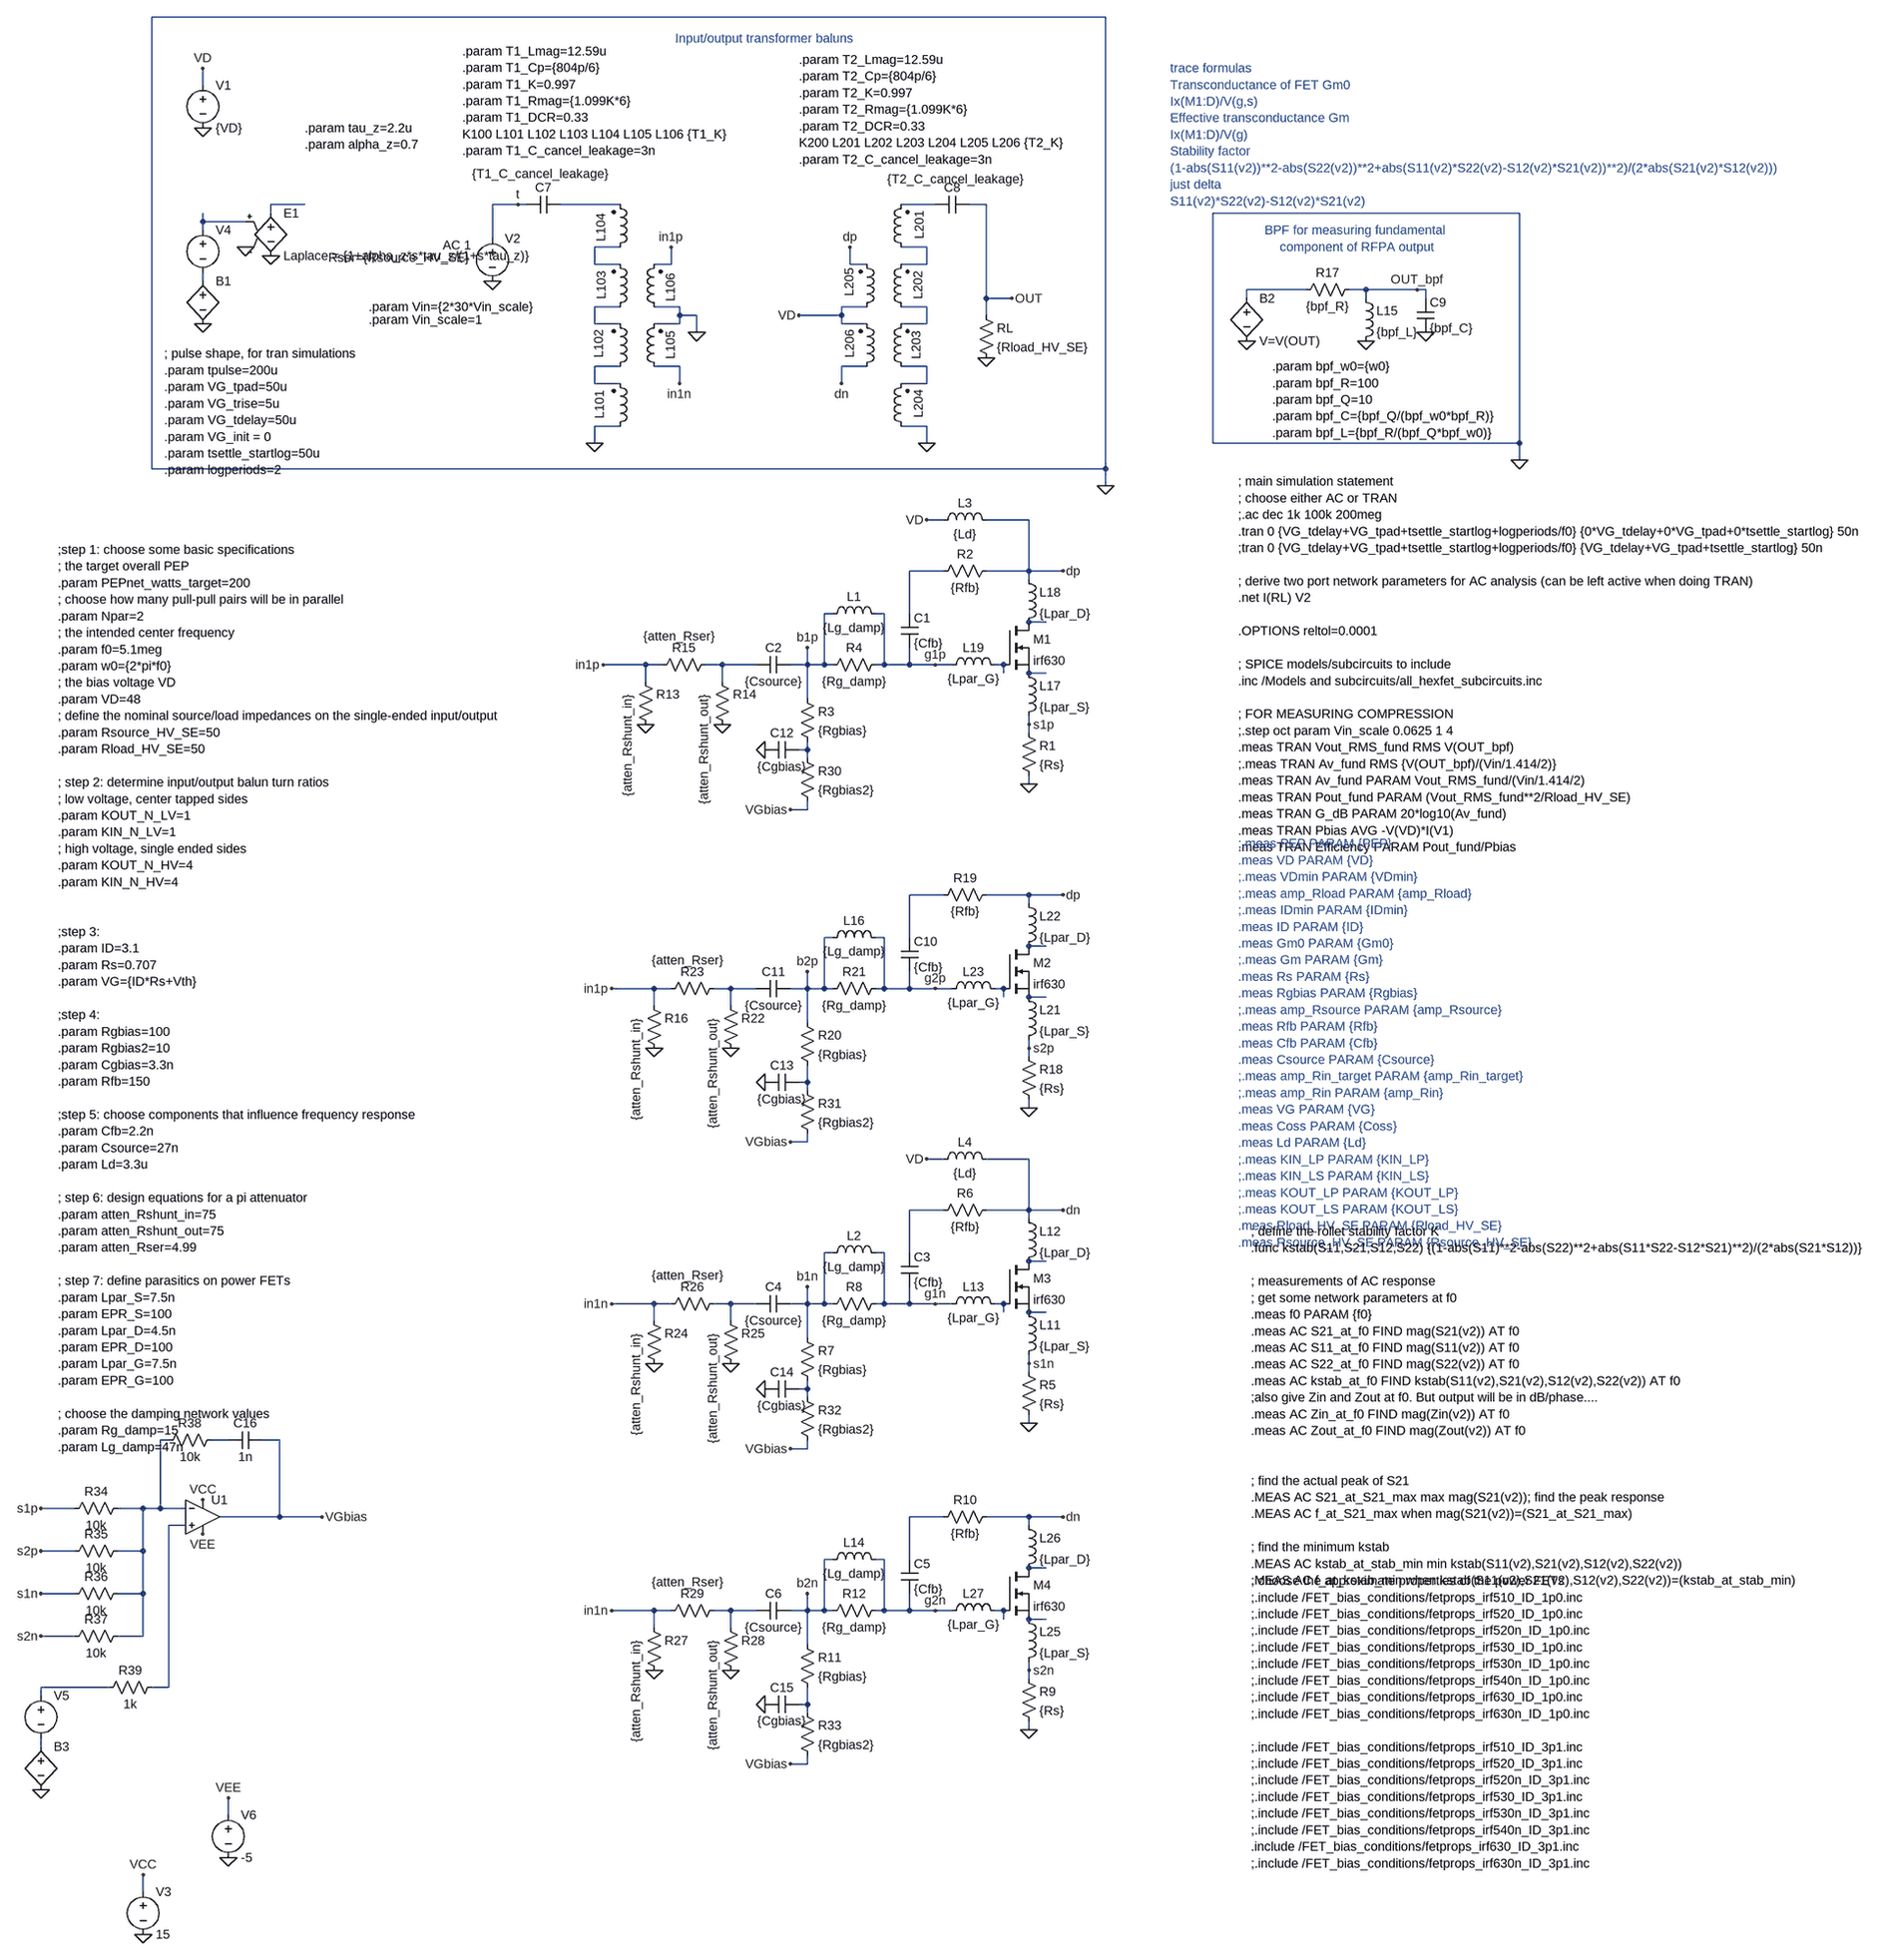
[diagram p0: schematic Easy_RFPA_S2_fixedvalues_DEMO_fasterblanking.asc]
Easy_RFPA_S2_fixedvalues_DEMO_fasterblanking.asc, the LTspice schematic file:
Version 4
SHEET 1 5344 3112
WIRE 160 -1280 -1632 -1280
WIRE -1536 -1152 -1536 -1184
WIRE -1344 -928 -1408 -928
WIRE -944 -928 -992 -928
WIRE -928 -928 -944 -928
WIRE -752 -928 -864 -928
WIRE -160 -928 -224 -928
WIRE -64 -928 -96 -928
WIRE -1408 -912 -1408 -928
WIRE 944 -912 368 -912
WIRE -1536 -896 -1536 -912
WIRE -1456 -896 -1536 -896
WIRE -1536 -880 -1536 -896
WIRE -992 -864 -992 -928
WIRE -752 -848 -800 -848
WIRE -176 -848 -224 -848
WIRE -800 -816 -800 -848
WIRE -752 -816 -800 -816
WIRE -656 -816 -656 -848
WIRE -656 -816 -688 -816
WIRE -320 -816 -320 -848
WIRE -288 -816 -320 -816
WIRE -176 -816 -176 -848
WIRE -176 -816 -224 -816
WIRE -1536 -784 -1536 -800
WIRE 544 -768 432 -768
WIRE 656 -768 624 -768
WIRE 752 -768 656 -768
WIRE 768 -768 752 -768
WIRE -64 -752 -64 -928
WIRE -16 -752 -64 -752
WIRE 432 -752 432 -768
WIRE 656 -752 656 -768
WIRE 768 -752 768 -768
WIRE -752 -736 -800 -736
WIRE -640 -736 -688 -736
WIRE -288 -736 -336 -736
WIRE -176 -736 -224 -736
WIRE -640 -720 -640 -736
WIRE -608 -720 -640 -720
WIRE -336 -720 -336 -736
WIRE -336 -720 -416 -720
WIRE -64 -720 -64 -752
WIRE -800 -704 -800 -736
WIRE -752 -704 -800 -704
WIRE -640 -704 -640 -720
WIRE -640 -704 -688 -704
WIRE -336 -704 -336 -720
WIRE -288 -704 -336 -704
WIRE -176 -704 -176 -736
WIRE -176 -704 -224 -704
WIRE -608 -688 -608 -720
WIRE -752 -624 -800 -624
WIRE -640 -624 -688 -624
WIRE -288 -624 -336 -624
WIRE -176 -624 -224 -624
WIRE -800 -592 -800 -624
WIRE -752 -592 -800 -592
WIRE -640 -592 -640 -624
WIRE -336 -592 -336 -624
WIRE -176 -592 -176 -624
WIRE -176 -592 -224 -592
WIRE -752 -512 -800 -512
WIRE -176 -512 -224 -512
WIRE -800 -480 -800 -512
WIRE -176 -480 -176 -512
WIRE 368 -480 368 -912
WIRE 944 -480 944 -912
WIRE 944 -480 368 -480
WIRE 944 -448 944 -480
WIRE -1632 -432 -1632 -1280
WIRE 160 -432 160 -1280
WIRE 160 -432 -1632 -432
WIRE 160 -400 160 -432
WIRE -144 -336 -176 -336
WIRE 16 -336 -64 -336
WIRE -144 -240 -208 -240
WIRE 16 -240 16 -336
WIRE 16 -240 -64 -240
WIRE 80 -240 16 -240
WIRE 16 -224 16 -240
WIRE -352 -160 -368 -160
WIRE -256 -160 -272 -160
WIRE -208 -160 -208 -240
WIRE 48 -144 16 -144
WIRE -704 -64 -784 -64
WIRE -672 -64 -704 -64
WIRE -560 -64 -592 -64
WIRE -496 -64 -560 -64
WIRE -400 -64 -400 -96
WIRE -400 -64 -432 -64
WIRE -368 -64 -368 -160
WIRE -368 -64 -400 -64
WIRE -352 -64 -368 -64
WIRE -256 -64 -256 -160
WIRE -256 -64 -272 -64
WIRE -208 -64 -208 -96
WIRE -208 -64 -256 -64
WIRE -160 -64 -208 -64
WIRE -128 -64 -160 -64
WIRE -32 -64 -48 -64
WIRE -32 -48 -32 -64
WIRE 48 -48 16 -48
WIRE -704 -32 -704 -64
WIRE -560 -32 -560 -64
WIRE -400 0 -400 -64
WIRE 16 48 16 32
WIRE 16 64 16 48
WIRE -400 96 -400 80
WIRE -400 96 -416 96
WIRE -400 112 -400 96
WIRE 16 160 16 144
WIRE -400 208 -400 192
WIRE -400 208 -432 208
WIRE -144 368 -208 368
WIRE 16 368 -64 368
WIRE 80 368 16 368
WIRE 16 384 16 368
WIRE -352 448 -368 448
WIRE -256 448 -272 448
WIRE -208 448 -208 368
WIRE 48 464 16 464
WIRE -688 544 -768 544
WIRE -656 544 -688 544
WIRE -544 544 -576 544
WIRE -496 544 -544 544
WIRE -400 544 -400 512
WIRE -400 544 -432 544
WIRE -368 544 -368 448
WIRE -368 544 -400 544
WIRE -352 544 -368 544
WIRE -256 544 -256 448
WIRE -256 544 -272 544
WIRE -208 544 -208 512
WIRE -208 544 -256 544
WIRE -160 544 -208 544
WIRE -128 544 -160 544
WIRE -32 544 -48 544
WIRE -32 560 -32 544
WIRE 48 560 16 560
WIRE -688 576 -688 544
WIRE -544 576 -544 544
WIRE -400 608 -400 544
WIRE 16 656 16 640
WIRE 16 672 16 656
WIRE -400 720 -400 688
WIRE -400 720 -416 720
WIRE -400 736 -400 720
WIRE 16 768 16 752
WIRE -400 832 -400 816
WIRE -400 832 -432 832
WIRE -144 864 -176 864
WIRE 16 864 -64 864
WIRE -144 960 -208 960
WIRE 16 960 16 864
WIRE 16 960 -64 960
WIRE 80 960 16 960
WIRE 16 976 16 960
WIRE -352 1040 -368 1040
WIRE -256 1040 -272 1040
WIRE -208 1040 -208 960
WIRE 48 1056 16 1056
WIRE -688 1136 -768 1136
WIRE -656 1136 -688 1136
WIRE -544 1136 -576 1136
WIRE -496 1136 -544 1136
WIRE -400 1136 -400 1104
WIRE -400 1136 -432 1136
WIRE -368 1136 -368 1040
WIRE -368 1136 -400 1136
WIRE -352 1136 -368 1136
WIRE -256 1136 -256 1040
WIRE -256 1136 -272 1136
WIRE -208 1136 -208 1104
WIRE -208 1136 -256 1136
WIRE -160 1136 -208 1136
WIRE -128 1136 -160 1136
WIRE -32 1136 -48 1136
WIRE -32 1152 -32 1136
WIRE 48 1152 16 1152
WIRE -688 1168 -688 1136
WIRE -544 1168 -544 1136
WIRE -400 1200 -400 1136
WIRE 16 1248 16 1232
WIRE 16 1264 16 1248
WIRE -400 1296 -400 1280
WIRE -400 1296 -416 1296
WIRE -400 1312 -400 1296
WIRE 16 1360 16 1344
WIRE -1600 1392 -1616 1392
WIRE -1488 1392 -1520 1392
WIRE -1392 1392 -1424 1392
WIRE -400 1408 -400 1392
WIRE -400 1408 -432 1408
WIRE -1776 1520 -1840 1520
WIRE -1648 1520 -1696 1520
WIRE -1616 1520 -1616 1392
WIRE -1616 1520 -1648 1520
WIRE -1568 1520 -1616 1520
WIRE -1392 1536 -1392 1392
WIRE -1392 1536 -1504 1536
WIRE -1312 1536 -1392 1536
WIRE -144 1536 -208 1536
WIRE 16 1536 -64 1536
WIRE 80 1536 16 1536
WIRE -1568 1552 -1600 1552
WIRE 16 1552 16 1536
WIRE -1776 1600 -1840 1600
WIRE -1648 1600 -1648 1520
WIRE -1648 1600 -1696 1600
WIRE -352 1616 -368 1616
WIRE -256 1616 -272 1616
WIRE -208 1616 -208 1536
WIRE 48 1632 16 1632
WIRE -1776 1680 -1840 1680
WIRE -1648 1680 -1648 1600
WIRE -1648 1680 -1696 1680
WIRE -688 1712 -768 1712
WIRE -656 1712 -688 1712
WIRE -544 1712 -576 1712
WIRE -496 1712 -544 1712
WIRE -400 1712 -400 1680
WIRE -400 1712 -432 1712
WIRE -368 1712 -368 1616
WIRE -368 1712 -400 1712
WIRE -352 1712 -368 1712
WIRE -256 1712 -256 1616
WIRE -256 1712 -272 1712
WIRE -208 1712 -208 1680
WIRE -208 1712 -256 1712
WIRE -160 1712 -208 1712
WIRE -128 1712 -160 1712
WIRE -32 1712 -48 1712
WIRE -32 1728 -32 1712
WIRE 48 1728 16 1728
WIRE -688 1744 -688 1712
WIRE -544 1744 -544 1712
WIRE -1776 1760 -1840 1760
WIRE -1648 1760 -1648 1680
WIRE -1648 1760 -1696 1760
WIRE -400 1776 -400 1712
WIRE 16 1824 16 1808
WIRE 16 1840 16 1824
WIRE -1712 1856 -1840 1856
WIRE -1600 1856 -1600 1552
WIRE -1600 1856 -1632 1856
WIRE -1840 1872 -1840 1856
WIRE -400 1888 -400 1856
WIRE -400 1888 -416 1888
WIRE -400 1904 -400 1888
WIRE 16 1936 16 1920
WIRE -1840 1968 -1840 1952
WIRE -400 2000 -400 1984
WIRE -400 2000 -432 2000
WIRE -1488 2096 -1488 2064
WIRE -1648 2240 -1648 2208
FLAG 16 160 0
FLAG -992 -784 0
FLAG -1536 -1072 0
FLAG 80 -240 dp
FLAG -160 -64 g1p
FLAG 16 48 s1p
FLAG -784 -64 in1p
FLAG -400 -96 b1p
FLAG -176 -336 VD
FLAG -432 208 VGbias
FLAG -64 -640 0
FLAG -1536 -1184 VD
FLAG -1312 1536 VGbias
FLAG -16 -752 OUT
FLAG -1536 -704 0
FLAG 432 -672 0
FLAG 656 -672 0
FLAG 768 -688 0
FLAG 752 -768 OUT_bpf
FLAG 16 768 0
FLAG 80 368 dp
FLAG -160 544 g2p
FLAG 16 656 s2p
FLAG -400 512 b2p
FLAG 16 1360 0
FLAG 80 960 dn
FLAG -160 1136 g1n
FLAG 16 1248 s1n
FLAG -400 1104 b1n
FLAG -176 864 VD
FLAG 16 1936 0
FLAG 80 1536 dn
FLAG -160 1712 g2n
FLAG 16 1824 s2n
FLAG -400 1680 b2n
FLAG -560 48 0
FLAG -704 48 0
FLAG -768 544 in1p
FLAG -544 656 0
FLAG -688 656 0
FLAG -768 1136 in1n
FLAG -544 1248 0
FLAG -688 1248 0
FLAG -768 1712 in1n
FLAG -544 1824 0
FLAG -688 1824 0
FLAG 944 -448 0
FLAG 160 -400 0
FLAG -656 -848 in1p
FLAG -640 -592 in1n
FLAG -800 -480 0
FLAG -608 -688 0
FLAG -944 -928 t
FLAG -176 -480 0
FLAG -320 -848 dp
FLAG -336 -592 dn
FLAG -416 -720 VD
FLAG -480 96 0
FLAG -432 832 VGbias
FLAG -480 720 0
FLAG -432 1408 VGbias
FLAG -480 1296 0
FLAG -432 2000 VGbias
FLAG -480 1888 0
FLAG -1456 -848 0
FLAG -1408 -832 0
FLAG -1648 2320 0
FLAG -1648 2208 VCC
FLAG -1840 1760 s2n
FLAG -1840 1680 s1n
FLAG -1840 1600 s2p
FLAG -1840 1520 s1p
FLAG -1840 2048 0
FLAG -1536 1504 VCC
FLAG -1488 2176 0
FLAG -1488 2064 VEE
FLAG -1536 1568 VEE
SYMBOL res 0 48 R0
SYMATTR InstName R1
SYMATTR Value {Rs}
SYMBOL res -48 -256 R90
WINDOW 0 0 56 VBottom 2
WINDOW 3 32 56 VTop 2
SYMATTR InstName R2
SYMATTR Value {Rfb}
SYMBOL cap -224 -160 R0
SYMATTR InstName C1
SYMATTR Value {Cfb}
SYMBOL res -416 -16 R0
SYMATTR InstName R3
SYMATTR Value {Rgbias}
SYMBOL res -256 -80 R90
WINDOW 0 0 56 VBottom 2
WINDOW 3 32 56 VTop 2
SYMATTR InstName R4
SYMATTR Value {Rg_damp}
SYMBOL ind -368 -144 R270
WINDOW 0 32 56 VTop 2
WINDOW 3 5 56 VBottom 2
SYMATTR InstName L1
SYMATTR Value {Lg_damp}
SYMBOL cap -432 -80 R90
WINDOW 0 0 32 VBottom 2
WINDOW 3 32 32 VTop 2
SYMATTR InstName C2
SYMATTR Value {Csource}
SYMBOL voltage -1536 -1168 R0
WINDOW 123 0 0 Left 0
WINDOW 39 0 0 Left 0
SYMATTR InstName V1
SYMATTR Value {VD}
SYMBOL ind -160 -320 R270
WINDOW 0 32 56 VTop 2
WINDOW 3 5 56 VBottom 2
SYMATTR InstName L3
SYMATTR Value {Ld}
SYMBOL res -80 -736 R0
SYMATTR InstName RL
SYMATTR Value {Rload_HV_SE}
SYMBOL voltage -1536 -896 R0
WINDOW 3 24 96 Invisible 2
WINDOW 123 0 0 Left 0
WINDOW 39 0 0 Left 0
SYMATTR Value PULSE({VG_init} {VG} {VG_tdelay} {VG_trise} {VG_trise} {VG_tpad*2+tpulse-VG_trise} 10m)
SYMATTR InstName V4
SYMBOL voltage -992 -880 R0
WINDOW 3 -46 82 Invisible 2
WINDOW 123 -40 28 Right 2
WINDOW 39 -45 52 Right 2
SYMATTR Value SINE(0 {Vin} {f0} {VG_tdelay+VG_tpad} 0 0 {tpulse*f0})
SYMATTR Value2 AC 1
SYMATTR SpiceLine Rser={Rsource_HV_SE}
SYMATTR InstName V2
SYMBOL bv -1536 -800 R0
WINDOW 3 24 96 Invisible 2
SYMATTR Value V=VG*smallsig()
SYMATTR InstName B1
SYMBOL bv 432 -768 R0
SYMATTR InstName B2
SYMATTR Value V=V(OUT)
SYMBOL res 640 -784 R90
WINDOW 0 0 56 VBottom 2
WINDOW 3 32 56 VTop 2
SYMATTR InstName R17
SYMATTR Value {bpf_R}
SYMBOL ind 640 -768 R0
SYMATTR InstName L15
SYMATTR Value {bpf_L}
SYMBOL cap 752 -752 R0
SYMATTR InstName C9
SYMATTR Value {bpf_C}
SYMBOL nmos -32 -144 R0
SYMATTR InstName M1
SYMATTR Value irf630
SYMATTR Prefix X
SYMBOL ind 0 -64 R0
SYMATTR InstName L17
SYMATTR Value {Lpar_S}
SYMATTR SpiceLine Rpar={EPR_S}
SYMBOL ind 0 -240 R0
SYMATTR InstName L18
SYMATTR Value {Lpar_D}
SYMATTR SpiceLine Rpar={EPR_D}
SYMBOL ind -144 -48 R270
WINDOW 0 32 56 VTop 2
WINDOW 3 5 56 VBottom 2
SYMATTR InstName L19
SYMATTR Value {Lpar_G}
SYMATTR SpiceLine Rpar={EPR_G}
SYMBOL res 0 656 R0
SYMATTR InstName R18
SYMATTR Value {Rs}
SYMBOL res -48 352 R90
WINDOW 0 0 56 VBottom 2
WINDOW 3 32 56 VTop 2
SYMATTR InstName R19
SYMATTR Value {Rfb}
SYMBOL cap -224 448 R0
SYMATTR InstName C10
SYMATTR Value {Cfb}
SYMBOL res -416 592 R0
SYMATTR InstName R20
SYMATTR Value {Rgbias}
SYMBOL res -256 528 R90
WINDOW 0 0 56 VBottom 2
WINDOW 3 32 56 VTop 2
SYMATTR InstName R21
SYMATTR Value {Rg_damp}
SYMBOL ind -368 464 R270
WINDOW 0 32 56 VTop 2
WINDOW 3 5 56 VBottom 2
SYMATTR InstName L16
SYMATTR Value {Lg_damp}
SYMBOL cap -432 528 R90
WINDOW 0 0 32 VBottom 2
WINDOW 3 32 32 VTop 2
SYMATTR InstName C11
SYMATTR Value {Csource}
SYMBOL nmos -32 464 R0
SYMATTR InstName M2
SYMATTR Value irf630
SYMATTR Prefix X
SYMBOL ind 0 544 R0
SYMATTR InstName L21
SYMATTR Value {Lpar_S}
SYMATTR SpiceLine Rpar={EPR_S}
SYMBOL ind 0 368 R0
SYMATTR InstName L22
SYMATTR Value {Lpar_D}
SYMATTR SpiceLine Rpar={EPR_D}
SYMBOL ind -144 560 R270
WINDOW 0 32 56 VTop 2
WINDOW 3 5 56 VBottom 2
SYMATTR InstName L23
SYMATTR Value {Lpar_G}
SYMATTR SpiceLine Rpar={EPR_G}
SYMBOL res 0 1248 R0
SYMATTR InstName R5
SYMATTR Value {Rs}
SYMBOL res -48 944 R90
WINDOW 0 0 56 VBottom 2
WINDOW 3 32 56 VTop 2
SYMATTR InstName R6
SYMATTR Value {Rfb}
SYMBOL cap -224 1040 R0
SYMATTR InstName C3
SYMATTR Value {Cfb}
SYMBOL res -416 1184 R0
SYMATTR InstName R7
SYMATTR Value {Rgbias}
SYMBOL res -256 1120 R90
WINDOW 0 0 56 VBottom 2
WINDOW 3 32 56 VTop 2
SYMATTR InstName R8
SYMATTR Value {Rg_damp}
SYMBOL ind -368 1056 R270
WINDOW 0 32 56 VTop 2
WINDOW 3 5 56 VBottom 2
SYMATTR InstName L2
SYMATTR Value {Lg_damp}
SYMBOL cap -432 1120 R90
WINDOW 0 0 32 VBottom 2
WINDOW 3 32 32 VTop 2
SYMATTR InstName C4
SYMATTR Value {Csource}
SYMBOL ind -160 880 R270
WINDOW 0 32 56 VTop 2
WINDOW 3 5 56 VBottom 2
SYMATTR InstName L4
SYMATTR Value {Ld}
SYMBOL nmos -32 1056 R0
SYMATTR InstName M3
SYMATTR Value irf630
SYMATTR Prefix X
SYMBOL ind 0 1136 R0
SYMATTR InstName L11
SYMATTR Value {Lpar_S}
SYMATTR SpiceLine Rpar={EPR_S}
SYMBOL ind 0 960 R0
SYMATTR InstName L12
SYMATTR Value {Lpar_D}
SYMATTR SpiceLine Rpar={EPR_D}
SYMBOL ind -144 1152 R270
WINDOW 0 32 56 VTop 2
WINDOW 3 5 56 VBottom 2
SYMATTR InstName L13
SYMATTR Value {Lpar_G}
SYMATTR SpiceLine Rpar={EPR_G}
SYMBOL res 0 1824 R0
SYMATTR InstName R9
SYMATTR Value {Rs}
SYMBOL res -48 1520 R90
WINDOW 0 0 56 VBottom 2
WINDOW 3 32 56 VTop 2
SYMATTR InstName R10
SYMATTR Value {Rfb}
SYMBOL cap -224 1616 R0
SYMATTR InstName C5
SYMATTR Value {Cfb}
SYMBOL res -416 1760 R0
SYMATTR InstName R11
SYMATTR Value {Rgbias}
SYMBOL res -256 1696 R90
WINDOW 0 0 56 VBottom 2
WINDOW 3 32 56 VTop 2
SYMATTR InstName R12
SYMATTR Value {Rg_damp}
SYMBOL ind -368 1632 R270
WINDOW 0 32 56 VTop 2
WINDOW 3 5 56 VBottom 2
SYMATTR InstName L14
SYMATTR Value {Lg_damp}
SYMBOL cap -432 1696 R90
WINDOW 0 0 32 VBottom 2
WINDOW 3 32 32 VTop 2
SYMATTR InstName C6
SYMATTR Value {Csource}
SYMBOL nmos -32 1632 R0
SYMATTR InstName M4
SYMATTR Value irf630
SYMATTR Prefix X
SYMBOL ind 0 1712 R0
SYMATTR InstName L25
SYMATTR Value {Lpar_S}
SYMATTR SpiceLine Rpar={EPR_S}
SYMBOL ind 0 1536 R0
SYMATTR InstName L26
SYMATTR Value {Lpar_D}
SYMATTR SpiceLine Rpar={EPR_D}
SYMBOL ind -144 1728 R270
WINDOW 0 32 56 VTop 2
WINDOW 3 5 56 VBottom 2
SYMATTR InstName L27
SYMATTR Value {Lpar_G}
SYMATTR SpiceLine Rpar={EPR_G}
SYMBOL res -720 -48 R0
WINDOW 3 -18 39 VRight 2
SYMATTR Value {atten_Rshunt_in}
SYMATTR InstName R13
SYMBOL res -576 -48 R0
WINDOW 3 -18 39 VRight 2
SYMATTR Value {atten_Rshunt_out}
SYMATTR InstName R14
SYMBOL res -576 -80 R90
WINDOW 0 0 56 VBottom 2
WINDOW 3 -53 65 VTop 2
SYMATTR InstName R15
SYMATTR Value {atten_Rser}
SYMBOL res -704 560 R0
WINDOW 3 -18 39 VRight 2
SYMATTR Value {atten_Rshunt_in}
SYMATTR InstName R16
SYMBOL res -560 560 R0
WINDOW 3 -18 39 VRight 2
SYMATTR Value {atten_Rshunt_out}
SYMATTR InstName R22
SYMBOL res -560 528 R90
WINDOW 0 0 56 VBottom 2
WINDOW 3 -53 65 VTop 2
SYMATTR InstName R23
SYMATTR Value {atten_Rser}
SYMBOL res -704 1152 R0
WINDOW 3 -18 39 VRight 2
SYMATTR Value {atten_Rshunt_in}
SYMATTR InstName R24
SYMBOL res -560 1152 R0
WINDOW 3 -18 39 VRight 2
SYMATTR Value {atten_Rshunt_out}
SYMATTR InstName R25
SYMBOL res -560 1120 R90
WINDOW 0 0 56 VBottom 2
WINDOW 3 -53 65 VTop 2
SYMATTR InstName R26
SYMATTR Value {atten_Rser}
SYMBOL res -704 1728 R0
WINDOW 3 -18 39 VRight 2
SYMATTR Value {atten_Rshunt_in}
SYMATTR InstName R27
SYMBOL res -560 1728 R0
WINDOW 3 -18 39 VRight 2
SYMATTR Value {atten_Rshunt_out}
SYMATTR InstName R28
SYMBOL res -560 1696 R90
WINDOW 0 0 56 VBottom 2
WINDOW 3 -53 65 VTop 2
SYMATTR InstName R29
SYMATTR Value {atten_Rser}
SYMBOL ind2 -768 -496 M180
WINDOW 3 36 40 Invisible 2
WINDOW 0 -22 83 VLeft 2
SYMATTR Value {T1_Lmag}
SYMATTR InstName L101
SYMATTR Type ind
SYMATTR SpiceLine Rser={T1_DCR} Rpar={T1_Rmag} Cpar={T1_Cp}
SYMBOL ind2 -768 -608 M180
WINDOW 3 36 40 Invisible 2
WINDOW 0 -24 85 VLeft 2
SYMATTR Value {T1_Lmag}
SYMATTR InstName L102
SYMATTR Type ind
SYMATTR SpiceLine Rser={T1_DCR} Rpar={T1_Rmag} Cpar={T1_Cp}
SYMBOL ind2 -768 -720 M180
WINDOW 3 36 40 Invisible 2
WINDOW 0 -19 83 VLeft 2
SYMATTR Value {T1_Lmag}
SYMATTR InstName L103
SYMATTR Type ind
SYMATTR SpiceLine Rser={T1_DCR} Rpar={T1_Rmag} Cpar={T1_Cp}
SYMBOL ind2 -768 -832 M180
WINDOW 3 36 40 Invisible 2
WINDOW 0 -20 80 VLeft 2
SYMATTR Value {T1_Lmag}
SYMATTR InstName L104
SYMATTR Type ind
SYMATTR SpiceLine Rser={T1_DCR} Rpar={T1_Rmag} Cpar={T1_Cp}
SYMBOL ind2 -672 -608 R180
WINDOW 3 36 40 Invisible 2
WINDOW 0 -15 29 VRight 2
SYMATTR Value {T1_Lmag}
SYMATTR InstName L105
SYMATTR Type ind
SYMATTR SpiceLine Rser={T1_DCR} Rpar={T1_Rmag} Cpar={T1_Cp}
SYMBOL ind2 -672 -720 R180
WINDOW 3 36 40 Invisible 2
WINDOW 0 -15 25 VRight 2
SYMATTR Value {T1_Lmag}
SYMATTR InstName L106
SYMATTR Type ind
SYMATTR SpiceLine Rser={T1_DCR} Rpar={T1_Rmag} Cpar={T1_Cp}
SYMBOL cap -928 -912 R270
WINDOW 3 89 27 VBottom 2
WINDOW 0 32 32 VTop 2
SYMATTR Value {T1_C_cancel_leakage}
SYMATTR InstName C7
SYMBOL ind2 -208 -496 R180
WINDOW 3 36 40 Invisible 2
WINDOW 0 -17 31 VRight 2
SYMATTR Value {T2_Lmag}
SYMATTR InstName L204
SYMATTR Type ind
SYMATTR SpiceLine Rser={T2_DCR} Rpar={T2_Rmag} Cpar={T2_Cp}
SYMBOL ind2 -208 -608 R180
WINDOW 3 36 40 Invisible 2
WINDOW 0 -13 29 VRight 2
SYMATTR Value {T2_Lmag}
SYMATTR InstName L203
SYMATTR Type ind
SYMATTR SpiceLine Rser={T2_DCR} Rpar={T2_Rmag} Cpar={T2_Cp}
SYMBOL ind2 -208 -720 R180
WINDOW 3 36 40 Invisible 2
WINDOW 0 -16 29 VRight 2
SYMATTR Value {T2_Lmag}
SYMATTR InstName L202
SYMATTR Type ind
SYMATTR SpiceLine Rser={T2_DCR} Rpar={T2_Rmag} Cpar={T2_Cp}
SYMBOL ind2 -208 -832 R180
WINDOW 3 36 40 Invisible 2
WINDOW 0 -19 31 VRight 2
SYMATTR Value {T2_Lmag}
SYMATTR InstName L201
SYMATTR Type ind
SYMATTR SpiceLine Rser={T2_DCR} Rpar={T2_Rmag} Cpar={T2_Cp}
SYMBOL ind2 -304 -608 M180
WINDOW 3 36 40 Invisible 2
WINDOW 0 -16 85 VLeft 2
SYMATTR Value {T2_Lmag}
SYMATTR InstName L206
SYMATTR Type ind
SYMATTR SpiceLine Rser={T2_DCR} Rpar={T2_Rmag} Cpar={T2_Cp}
SYMBOL ind2 -304 -720 M180
WINDOW 3 36 40 Invisible 2
WINDOW 0 -17 89 VLeft 2
SYMATTR Value {T2_Lmag}
SYMATTR InstName L205
SYMATTR Type ind
SYMATTR SpiceLine Rser={T2_DCR} Rpar={T2_Rmag} Cpar={T2_Cp}
SYMBOL cap -96 -944 R90
WINDOW 3 -47 25 VTop 2
WINDOW 0 0 32 VBottom 2
SYMATTR Value {T2_C_cancel_leakage}
SYMATTR InstName C8
SYMBOL res -416 96 R0
SYMATTR InstName R30
SYMATTR Value {Rgbias2}
SYMBOL cap -416 80 R90
WINDOW 0 0 32 VBottom 2
WINDOW 3 32 32 VTop 2
SYMATTR InstName C12
SYMATTR Value {Cgbias}
SYMBOL res -416 720 R0
SYMATTR InstName R31
SYMATTR Value {Rgbias2}
SYMBOL cap -416 704 R90
WINDOW 0 0 32 VBottom 2
WINDOW 3 32 32 VTop 2
SYMATTR InstName C13
SYMATTR Value {Cgbias}
SYMBOL res -416 1296 R0
SYMATTR InstName R32
SYMATTR Value {Rgbias2}
SYMBOL cap -416 1280 R90
WINDOW 0 0 32 VBottom 2
WINDOW 3 32 32 VTop 2
SYMATTR InstName C14
SYMATTR Value {Cgbias}
SYMBOL res -416 1888 R0
SYMATTR InstName R33
SYMATTR Value {Rgbias2}
SYMBOL cap -416 1872 R90
WINDOW 0 0 32 VBottom 2
WINDOW 3 32 32 VTop 2
SYMATTR InstName C15
SYMATTR Value {Cgbias}
SYMBOL e -1408 -928 R0
SYMATTR InstName E1
SYMATTR Value Laplace = {1+alpha_z*s*tau_z/(1+s*tau_z)}
SYMBOL Opamps\\UniversalOpamp2 -1536 1536 R0
SYMATTR InstName U1
SYMATTR Value2 Avol=1Meg GBW=50Meg Slew=10Meg
SYMATTR SpiceLine ilimit=1 rail=0 Vos=0 phimargin=45
SYMBOL voltage -1648 2224 R0
WINDOW 123 0 0 Left 0
WINDOW 39 0 0 Left 0
SYMATTR InstName V3
SYMATTR Value 15
SYMBOL res -1680 1504 R90
WINDOW 0 0 56 VBottom 2
WINDOW 3 32 56 VTop 2
SYMATTR InstName R34
SYMATTR Value 10k
SYMBOL res -1680 1584 R90
WINDOW 0 0 56 VBottom 2
WINDOW 3 32 56 VTop 2
SYMATTR InstName R35
SYMATTR Value 10k
SYMBOL res -1680 1664 R90
WINDOW 0 0 56 VBottom 2
WINDOW 3 32 56 VTop 2
SYMATTR InstName R36
SYMATTR Value 10k
SYMBOL res -1680 1744 R90
WINDOW 0 0 56 VBottom 2
WINDOW 3 32 56 VTop 2
SYMATTR InstName R37
SYMATTR Value 10k
SYMBOL voltage -1840 1856 R0
WINDOW 3 24 96 Invisible 2
WINDOW 123 0 0 Left 0
WINDOW 39 0 0 Left 0
SYMATTR Value PULSE(0.1 {ID*Rs} {VG_tdelay} {VG_trise} {VG_trise} {VG_tpad*2+tpulse-VG_trise} 10m)
SYMATTR InstName V5
SYMBOL bv -1840 1952 R0
WINDOW 3 24 96 Invisible 2
SYMATTR Value V=ID*Rs*smallsig()
SYMATTR InstName B3
SYMBOL res -1504 1376 R90
WINDOW 0 0 56 VBottom 2
WINDOW 3 32 56 VTop 2
SYMATTR InstName R38
SYMATTR Value 10k
SYMBOL res -1616 1840 R90
WINDOW 0 0 56 VBottom 2
WINDOW 3 32 56 VTop 2
SYMATTR InstName R39
SYMATTR Value 1k
SYMBOL cap -1424 1376 R90
WINDOW 0 0 32 VBottom 2
WINDOW 3 32 32 VTop 2
SYMATTR InstName C16
SYMATTR Value 1n
SYMBOL voltage -1488 2080 R0
WINDOW 123 0 0 Left 0
WINDOW 39 0 0 Left 0
SYMATTR InstName V6
SYMATTR Value -5
TEXT 416 -408 Left 2 !; main simulation statement\n; choose either AC or TRAN\n;.ac dec 1k 100k 200meg\n.tran 0 {VG_tdelay+VG_tpad+tsettle_startlog+logperiods/f0} {0*VG_tdelay+0*VG_tpad+0*tsettle_startlog} 50n\n;tran 0 {VG_tdelay+VG_tpad+tsettle_startlog+logperiods/f0} {VG_tdelay+VG_tpad+tsettle_startlog} 50n\n \n; derive two port network parameters for AC analysis (can be left active when doing TRAN)\n.net I(RL) V2\n \n.OPTIONS reltol=0.0001\n \n; SPICE models/subcircuits to include\n.inc /Models and subcircuits/all_hexfet_subcircuits.inc\n \n; FOR MEASURING COMPRESSION\n;.step oct param Vin_scale 0.0625 1 4\n.meas TRAN Vout_RMS_fund RMS V(OUT_bpf)\n;.meas TRAN Av_fund RMS {V(OUT_bpf)/(Vin/1.414/2)}\n.meas TRAN Av_fund PARAM Vout_RMS_fund/(Vin/1.414/2)\n.meas TRAN Pout_fund PARAM (Vout_RMS_fund**2/Rload_HV_SE)\n.meas TRAN G_dB PARAM 20*log10(Av_fund)\n.meas TRAN Pbias AVG -V(VD)*I(V1)\n.meas TRAN Efficiency PARAM Pout_fund/Pbias
TEXT 288 -1184 Left 2 ;trace formulas\nTransconductance of FET Gm0\nIx(M1:D)/V(g,s)\nEffective transconductance Gm\nIx(M1:D)/V(g)\nStability factor\n(1-abs(S11(v2))**2-abs(S22(v2))**2+abs(S11(v2)*S22(v2)-S12(v2)*S21(v2))**2)/(2*abs(S21(v2)*S12(v2)))\njust delta\nS11(v2)*S22(v2)-S12(v2)*S21(v2)
TEXT -1808 -280 Left 2 !;step 1: choose some basic specifications\n; the target overall PEP\n.param PEPnet_watts_target=200\n; choose how many pull-pull pairs will be in parallel\n.param Npar=2\n; the intended center frequency\n.param f0=5.1meg\n.param w0={2*pi*f0}\n; the bias voltage VD\n.param VD=48\n; define the nominal source/load impedances on the single-ended input/output \n.param Rsource_HV_SE=50\n.param Rload_HV_SE=50\n \n; step 2: determine input/output balun turn ratios\n; low voltage, center tapped sides\n.param KOUT_N_LV=1\n.param KIN_N_LV=1\n; high voltage, single ended sides\n.param KOUT_N_HV=4\n.param KIN_N_HV=4\n \n \n;step 3:\n.param ID=3.1\n.param Rs=0.707\n.param VG={ID*Rs+Vth}\n \n;step 4:\n.param Rgbias=100\n.param Rgbias2=10\n.param Cgbias=3.3n\n.param Rfb=150\n \n;step 5: choose components that influence frequency response\n.param Cfb=2.2n\n.param Csource=27n\n.param Ld=3.3u\n \n; step 6: design equations for a pi attenuator\n.param atten_Rshunt_in=75\n.param atten_Rshunt_out=75\n.param atten_Rser=4.99\n \n; step 7: define parasitics on power FETs\n.param Lpar_S=7.5n\n.param EPR_S=100\n.param Lpar_D=4.5n\n.param EPR_D=100\n.param Lpar_G=7.5n\n.param EPR_G=100\n \n; choose the damping network values\n.param Rg_damp=15\n.param Lg_damp=47n
TEXT 416 272 Left 2 ;;.meas PEP PARAM {PEP}\n.meas VD PARAM {VD}\n;.meas VDmin PARAM {VDmin}\n;.meas amp_Rload PARAM {amp_Rload}\n;.meas IDmin PARAM {IDmin}\n.meas ID PARAM {ID}\n.meas Gm0 PARAM {Gm0}\n;.meas Gm PARAM {Gm}\n.meas Rs PARAM {Rs}\n.meas Rgbias PARAM {Rgbias}\n;.meas amp_Rsource PARAM {amp_Rsource}\n.meas Rfb PARAM {Rfb}\n.meas Cfb PARAM {Cfb}\n.meas Csource PARAM {Csource}\n;.meas amp_Rin_target PARAM {amp_Rin_target}\n;.meas amp_Rin PARAM {amp_Rin}\n.meas VG PARAM {VG}\n.meas Coss PARAM {Coss}\n.meas Ld PARAM {Ld}\n;.meas KIN_LP PARAM {KIN_LP}\n;.meas KIN_LS PARAM {KIN_LS}\n;.meas KOUT_LP PARAM {KOUT_LP}\n;.meas KOUT_LS PARAM {KOUT_LS}\n.meas Rload_HV_SE PARAM {Rload_HV_SE}\n.meas Rsource_HV_SE PARAM {Rsource_HV_SE}
TEXT -1608 -648 Left 2 !; pulse shape, for tran simulations\n.param tpulse=200u\n.param VG_tpad=50u\n.param VG_trise=5u\n.param VG_tdelay=50u\n.param VG_init = 0\n.param tsettle_startlog=50u\n.param logperiods=2
TEXT -1224 -712 Left 2 !.param Vin_scale=1
TEXT 480 -624 Left 2 !.param bpf_w0={w0}\n.param bpf_R=100\n.param bpf_Q=10\n.param bpf_C={bpf_Q/(bpf_w0*bpf_R)}\n.param bpf_L={bpf_R/(bpf_Q*bpf_w0)}
TEXT 640 -864 Center 2 ;BPF for measuring fundamental \ncomponent of RFPA output
TEXT -648 -1240 Left 2 ;Input/output transformer baluns
TEXT 440 1656 Left 2 !; choose the approximate properties of the power FETs\n;.include /FET_bias_conditions/fetprops_irf510_ID_1p0.inc\n;.include /FET_bias_conditions/fetprops_irf520_ID_1p0.inc\n;.include /FET_bias_conditions/fetprops_irf520n_ID_1p0.inc\n;.include /FET_bias_conditions/fetprops_irf530_ID_1p0.inc\n;.include /FET_bias_conditions/fetprops_irf530n_ID_1p0.inc\n;.include /FET_bias_conditions/fetprops_irf540n_ID_1p0.inc\n;.include /FET_bias_conditions/fetprops_irf630_ID_1p0.inc\n;.include /FET_bias_conditions/fetprops_irf630n_ID_1p0.inc\n \n;.include /FET_bias_conditions/fetprops_irf510_ID_3p1.inc\n;.include /FET_bias_conditions/fetprops_irf520_ID_3p1.inc\n;.include /FET_bias_conditions/fetprops_irf520n_ID_3p1.inc\n;.include /FET_bias_conditions/fetprops_irf530_ID_3p1.inc\n;.include /FET_bias_conditions/fetprops_irf530n_ID_3p1.inc\n;.include /FET_bias_conditions/fetprops_irf540n_ID_3p1.inc\n.include /FET_bias_conditions/fetprops_irf630_ID_3p1.inc\n;.include /FET_bias_conditions/fetprops_irf630n_ID_3p1.inc
TEXT 440 1000 Left 2 !; define the rollet stability factor K\n.func kstab(S11,S21,S12,S22) {(1-abs(S11)**2-abs(S22)**2+abs(S11*S22-S12*S21)**2)/(2*abs(S21*S12))}\n \n; measurements of AC response\n; get some network parameters at f0\n.meas f0 PARAM {f0}\n.meas AC S21_at_f0 FIND mag(S21(v2)) AT f0\n.meas AC S11_at_f0 FIND mag(S11(v2)) AT f0\n.meas AC S22_at_f0 FIND mag(S22(v2)) AT f0\n.meas AC kstab_at_f0 FIND kstab(S11(v2),S21(v2),S12(v2),S22(v2)) AT f0\n;also give Zin and Zout at f0. But output will be in dB/phase....\n.meas AC Zin_at_f0 FIND mag(Zin(v2)) AT f0\n.meas AC Zout_at_f0 FIND mag(Zout(v2)) AT f0\n \n \n; find the actual peak of S21\n.MEAS AC S21_at_S21_max max mag(S21(v2)); find the peak response\n.MEAS AC f_at_S21_max when mag(S21(v2))=(S21_at_S21_max)\n \n; find the minimum kstab\n.MEAS AC kstab_at_stab_min min kstab(S11(v2),S21(v2),S12(v2),S22(v2))\n.MEAS AC f_at_kstab_min when kstab(S11(v2),S21(v2),S12(v2),S22(v2))=(kstab_at_stab_min)
TEXT -416 -1200 Left 2 !.param T2_Lmag=12.59u\n.param T2_Cp={804p/6}\n.param T2_K=0.997\n.param T2_Rmag={1.099K*6}\n.param T2_DCR=0.33\nK200 L201 L202 L203 L204 L205 L206 {T2_K}\n.param T2_C_cancel_leakage=3n
TEXT -1048 -1216 Left 2 !.param T1_Lmag=12.59u\n.param T1_Cp={804p/6}\n.param T1_K=0.997\n.param T1_Rmag={1.099K*6}\n.param T1_DCR=0.33\nK100 L101 L102 L103 L104 L105 L106 {T1_K}\n.param T1_C_cancel_leakage=3n
TEXT -1224 -736 Left 2 !.param Vin={2*30*Vin_scale}
TEXT -1344 -1072 Left 2 !.param tau_z=2.2u\n.param alpha_z=0.7

The netlist it stands for:
* Easy_RFPA_S2_fixedvalues_DEMO_fasterblanking.asc
R1 s1p 0 {Rs}
R2 dp N013 {Rfb}
C1 N013 g1p {Cfb}
R3 b1p N018 {Rgbias}
R4 g1p b1p {Rg_damp}
L1 b1p g1p {Lg_damp}
C2 b1p N015 {Csource}
V1 VD 0 {VD}
L3 VD dp {Ld}
RL OUT 0 {Rload_HV_SE}
V4 N004 N007 PULSE({VG_init} {VG} {VG_tdelay} {VG_trise} {VG_trise} {VG_tpad*2+tpulse-VG_trise} 10m)
V2 t 0 SINE(0 {Vin} {f0} {VG_tdelay+VG_tpad} 0 0 {tpulse*f0}) AC 1 Rser={Rsource_HV_SE}
B1 N007 0 V=VG*smallsig()
B2 N008 0 V=V(OUT)
R17 OUT_bpf N008 {bpf_R}
L15 OUT_bpf 0 {bpf_L}
C9 OUT_bpf 0 {bpf_C}
XM1 N014 N016 N017 irf630  ; pins D G S
L17 N017 s1p {Lpar_S} Rpar={EPR_S}
L18 dp N014 {Lpar_D} Rpar={EPR_D}
L19 g1p N016 {Lpar_G} Rpar={EPR_G}
R18 s2p 0 {Rs}
R19 dp N019 {Rfb}
C10 N019 g2p {Cfb}
R20 b2p N024 {Rgbias}
R21 g2p b2p {Rg_damp}
L16 b2p g2p {Lg_damp}
C11 b2p N021 {Csource}
XM2 N020 N022 N023 irf630  ; pins D G S
L21 N023 s2p {Lpar_S} Rpar={EPR_S}
L22 dp N020 {Lpar_D} Rpar={EPR_D}
L23 g2p N022 {Lpar_G} Rpar={EPR_G}
R5 s1n 0 {Rs}
R6 dn N025 {Rfb}
C3 N025 g1n {Cfb}
R7 b1n N030 {Rgbias}
R8 g1n b1n {Rg_damp}
L2 b1n g1n {Lg_damp}
C4 b1n N027 {Csource}
L4 VD dn {Ld}
XM3 N026 N028 N029 irf630  ; pins D G S
L11 N029 s1n {Lpar_S} Rpar={EPR_S}
L12 dn N026 {Lpar_D} Rpar={EPR_D}
L13 g1n N028 {Lpar_G} Rpar={EPR_G}
R9 s2n 0 {Rs}
R10 dn N033 {Rfb}
C5 N033 g2n {Cfb}
R11 b2n N040 {Rgbias}
R12 g2n b2n {Rg_damp}
L14 b2n g2n {Lg_damp}
C6 b2n N036 {Csource}
XM4 N035 N037 N038 irf630  ; pins D G S
L25 N038 s2n {Lpar_S} Rpar={EPR_S}
L26 dn N035 {Lpar_D} Rpar={EPR_D}
L27 g2n N037 {Lpar_G} Rpar={EPR_G}
R13 in1p 0 {atten_Rshunt_in}
R14 N015 0 {atten_Rshunt_out}
R15 N015 in1p {atten_Rser}
R16 in1p 0 {atten_Rshunt_in}
R22 N021 0 {atten_Rshunt_out}
R23 N021 in1p {atten_Rser}
R24 in1n 0 {atten_Rshunt_in}
R25 N027 0 {atten_Rshunt_out}
R26 N027 in1n {atten_Rser}
R27 in1n 0 {atten_Rshunt_in}
R28 N036 0 {atten_Rshunt_out}
R29 N036 in1n {atten_Rser}
L101 0 N011 {T1_Lmag} Rser={T1_DCR} Rpar={T1_Rmag} Cpar={T1_Cp}
L102 N011 N009 {T1_Lmag} Rser={T1_DCR} Rpar={T1_Rmag} Cpar={T1_Cp}
L103 N009 N005 {T1_Lmag} Rser={T1_DCR} Rpar={T1_Rmag} Cpar={T1_Cp}
L104 N005 N002 {T1_Lmag} Rser={T1_DCR} Rpar={T1_Rmag} Cpar={T1_Cp}
L105 in1n 0 {T1_Lmag} Rser={T1_DCR} Rpar={T1_Rmag} Cpar={T1_Cp}
L106 0 in1p {T1_Lmag} Rser={T1_DCR} Rpar={T1_Rmag} Cpar={T1_Cp}
C7 t N002 {T1_C_cancel_leakage}
L204 0 N012 {T2_Lmag} Rser={T2_DCR} Rpar={T2_Rmag} Cpar={T2_Cp}
L203 N012 N010 {T2_Lmag} Rser={T2_DCR} Rpar={T2_Rmag} Cpar={T2_Cp}
L202 N010 N006 {T2_Lmag} Rser={T2_DCR} Rpar={T2_Rmag} Cpar={T2_Cp}
L201 N006 N003 {T2_Lmag} Rser={T2_DCR} Rpar={T2_Rmag} Cpar={T2_Cp}
L206 dn VD {T2_Lmag} Rser={T2_DCR} Rpar={T2_Rmag} Cpar={T2_Cp}
L205 VD dp {T2_Lmag} Rser={T2_DCR} Rpar={T2_Rmag} Cpar={T2_Cp}
C8 OUT N003 {T2_C_cancel_leakage}
R30 N018 VGbias {Rgbias2}
C12 N018 0 {Cgbias}
R31 N024 VGbias {Rgbias2}
C13 N024 0 {Cgbias}
R32 N030 VGbias {Rgbias2}
C14 N030 0 {Cgbias}
R33 N040 VGbias {Rgbias2}
C15 N040 0 {Cgbias}
E1 N001 0 N004 0 Laplace = {1+alpha_z*s*tau_z/(1+s*tau_z)}
XU1 N034 N031 VCC VEE VGbias level.2 Avol=1Meg GBW=50Meg Slew=10Meg ilimit=1 rail=0 Vos=0 phimargin=45 en=0 enk=0 in=0 ink=0 Rin=500Meg  ; pins IN+ IN- V+ V- OUT
V3 VCC 0 15
R34 N031 s1p 10k
R35 N031 s2p 10k
R36 N031 s1n 10k
R37 N031 s2n 10k
V5 N039 N041 PULSE(0.1 {ID*Rs} {VG_tdelay} {VG_trise} {VG_trise} {VG_tpad*2+tpulse-VG_trise} 10m)
B3 N041 0 V=ID*Rs*smallsig()
R38 N032 N031 10k
R39 N034 N039 1k
C16 VGbias N032 1n
V6 VEE 0 -5
; main simulation statement
; choose either AC or TRAN
;.ac dec 1k 100k 200meg
.tran 0 {VG_tdelay+VG_tpad+tsettle_startlog+logperiods/f0} {0*VG_tdelay+0*VG_tpad+0*tsettle_startlog} 50n
;tran 0 {VG_tdelay+VG_tpad+tsettle_startlog+logperiods/f0} {VG_tdelay+VG_tpad+tsettle_startlog} 50n
; derive two port network parameters for AC analysis (can be left active when doing TRAN)
.net I(RL) V2
.OPTIONS reltol=0.0001
; SPICE models/subcircuits to include
.inc /Models and subcircuits/all_hexfet_subcircuits.inc
; FOR MEASURING COMPRESSION
;.step oct param Vin_scale 0.0625 1 4
.meas TRAN Vout_RMS_fund RMS V(OUT_bpf)
;.meas TRAN Av_fund RMS {V(OUT_bpf)/(Vin/1.414/2)}
.meas TRAN Av_fund PARAM Vout_RMS_fund/(Vin/1.414/2)
.meas TRAN Pout_fund PARAM (Vout_RMS_fund**2/Rload_HV_SE)
.meas TRAN G_dB PARAM 20*log10(Av_fund)
.meas TRAN Pbias AVG -V(VD)*I(V1)
.meas TRAN Efficiency PARAM Pout_fund/Pbias
* trace formulas
* Transconductance of FET Gm0
* Ix(M1:D)/V(g,s)
* Effective transconductance Gm
* Ix(M1:D)/V(g)
* Stability factor
* (1-abs(S11(v2))**2-abs(S22(v2))**2+abs(S11(v2)*S22(v2)-S12(v2)*S21(v2))**2)/(2*abs(S21(v2)*S12(v2)))
* just delta
* S11(v2)*S22(v2)-S12(v2)*S21(v2)
;step 1: choose some basic specifications
; the target overall PEP
.param PEPnet_watts_target=200
; choose how many pull-pull pairs will be in parallel
.param Npar=2
; the intended center frequency
.param f0=5.1meg
.param w0={2*pi*f0}
; the bias voltage VD
.param VD=48
; define the nominal source/load impedances on the single-ended input/output
.param Rsource_HV_SE=50
.param Rload_HV_SE=50
; step 2: determine input/output balun turn ratios
; low voltage, center tapped sides
.param KOUT_N_LV=1
.param KIN_N_LV=1
; high voltage, single ended sides
.param KOUT_N_HV=4
.param KIN_N_HV=4
;step 3:
.param ID=3.1
.param Rs=0.707
.param VG={ID*Rs+Vth}
;step 4:
.param Rgbias=100
.param Rgbias2=10
.param Cgbias=3.3n
.param Rfb=150
;step 5: choose components that influence frequency response
.param Cfb=2.2n
.param Csource=27n
.param Ld=3.3u
; step 6: design equations for a pi attenuator
.param atten_Rshunt_in=75
.param atten_Rshunt_out=75
.param atten_Rser=4.99
; step 7: define parasitics on power FETs
.param Lpar_S=7.5n
.param EPR_S=100
.param Lpar_D=4.5n
.param EPR_D=100
.param Lpar_G=7.5n
.param EPR_G=100
; choose the damping network values
.param Rg_damp=15
.param Lg_damp=47n
* ;.meas PEP PARAM {PEP}
* .meas VD PARAM {VD}
* ;.meas VDmin PARAM {VDmin}
* ;.meas amp_Rload PARAM {amp_Rload}
* ;.meas IDmin PARAM {IDmin}
* .meas ID PARAM {ID}
* .meas Gm0 PARAM {Gm0}
* ;.meas Gm PARAM {Gm}
* .meas Rs PARAM {Rs}
* .meas Rgbias PARAM {Rgbias}
* ;.meas amp_Rsource PARAM {amp_Rsource}
* .meas Rfb PARAM {Rfb}
* .meas Cfb PARAM {Cfb}
* .meas Csource PARAM {Csource}
* ;.meas amp_Rin_target PARAM {amp_Rin_target}
* ;.meas amp_Rin PARAM {amp_Rin}
* .meas VG PARAM {VG}
* .meas Coss PARAM {Coss}
* .meas Ld PARAM {Ld}
* ;.meas KIN_LP PARAM {KIN_LP}
* ;.meas KIN_LS PARAM {KIN_LS}
* ;.meas KOUT_LP PARAM {KOUT_LP}
* ;.meas KOUT_LS PARAM {KOUT_LS}
* .meas Rload_HV_SE PARAM {Rload_HV_SE}
* .meas Rsource_HV_SE PARAM {Rsource_HV_SE}
; pulse shape, for tran simulations
.param tpulse=200u
.param VG_tpad=50u
.param VG_trise=5u
.param VG_tdelay=50u
.param VG_init = 0
.param tsettle_startlog=50u
.param logperiods=2
.param Vin_scale=1
.param bpf_w0={w0}
.param bpf_R=100
.param bpf_Q=10
.param bpf_C={bpf_Q/(bpf_w0*bpf_R)}
.param bpf_L={bpf_R/(bpf_Q*bpf_w0)}
* BPF for measuring fundamental
* component of RFPA output
* Input/output transformer baluns
; choose the approximate properties of the power FETs
;.include /FET_bias_conditions/fetprops_irf510_ID_1p0.inc
;.include /FET_bias_conditions/fetprops_irf520_ID_1p0.inc
;.include /FET_bias_conditions/fetprops_irf520n_ID_1p0.inc
;.include /FET_bias_conditions/fetprops_irf530_ID_1p0.inc
;.include /FET_bias_conditions/fetprops_irf530n_ID_1p0.inc
;.include /FET_bias_conditions/fetprops_irf540n_ID_1p0.inc
;.include /FET_bias_conditions/fetprops_irf630_ID_1p0.inc
;.include /FET_bias_conditions/fetprops_irf630n_ID_1p0.inc
;.include /FET_bias_conditions/fetprops_irf510_ID_3p1.inc
;.include /FET_bias_conditions/fetprops_irf520_ID_3p1.inc
;.include /FET_bias_conditions/fetprops_irf520n_ID_3p1.inc
;.include /FET_bias_conditions/fetprops_irf530_ID_3p1.inc
;.include /FET_bias_conditions/fetprops_irf530n_ID_3p1.inc
;.include /FET_bias_conditions/fetprops_irf540n_ID_3p1.inc
.include /FET_bias_conditions/fetprops_irf630_ID_3p1.inc
;.include /FET_bias_conditions/fetprops_irf630n_ID_3p1.inc
; define the rollet stability factor K
.func kstab(S11,S21,S12,S22) {(1-abs(S11)**2-abs(S22)**2+abs(S11*S22-S12*S21)**2)/(2*abs(S21*S12))}
; measurements of AC response
; get some network parameters at f0
.meas f0 PARAM {f0}
.meas AC S21_at_f0 FIND mag(S21(v2)) AT f0
.meas AC S11_at_f0 FIND mag(S11(v2)) AT f0
.meas AC S22_at_f0 FIND mag(S22(v2)) AT f0
.meas AC kstab_at_f0 FIND kstab(S11(v2),S21(v2),S12(v2),S22(v2)) AT f0
;also give Zin and Zout at f0. But output will be in dB/phase....
.meas AC Zin_at_f0 FIND mag(Zin(v2)) AT f0
.meas AC Zout_at_f0 FIND mag(Zout(v2)) AT f0
; find the actual peak of S21
.MEAS AC S21_at_S21_max max mag(S21(v2)); find the peak response
.MEAS AC f_at_S21_max when mag(S21(v2))=(S21_at_S21_max)
; find the minimum kstab
.MEAS AC kstab_at_stab_min min kstab(S11(v2),S21(v2),S12(v2),S22(v2))
.MEAS AC f_at_kstab_min when kstab(S11(v2),S21(v2),S12(v2),S22(v2))=(kstab_at_stab_min)
.param T2_Lmag=12.59u
.param T2_Cp={804p/6}
.param T2_K=0.997
.param T2_Rmag={1.099K*6}
.param T2_DCR=0.33
K200 L201 L202 L203 L204 L205 L206 {T2_K}
.param T2_C_cancel_leakage=3n
.param T1_Lmag=12.59u
.param T1_Cp={804p/6}
.param T1_K=0.997
.param T1_Rmag={1.099K*6}
.param T1_DCR=0.33
K100 L101 L102 L103 L104 L105 L106 {T1_K}
.param T1_C_cancel_leakage=3n
.param Vin={2*30*Vin_scale}
.param tau_z=2.2u
.param alpha_z=0.7
.lib UniversalOpamps2.sub
.backanno
.end